# Altium project PCB_Buck_2.PrjPcb
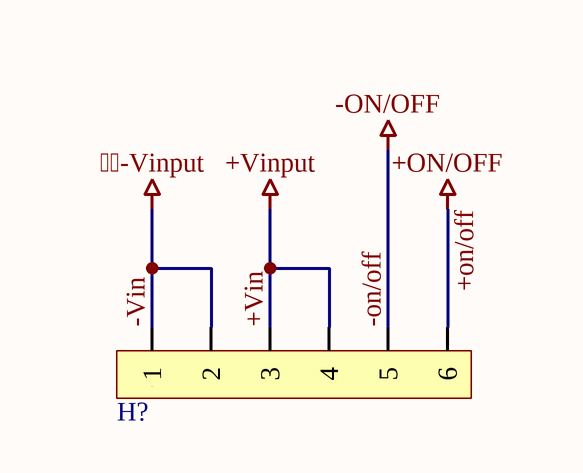
[diagram p0: Sheet1.SchDoc]
1 sheet, 1 parts. Net scope: global (net labels, ports and power ports of the same name join across sheets).
Board file: PCB1.PcbDoc

## Sheet Sheet1.SchDoc
size A4; SheetNumber: 1; SheetTotal: 1

### Parts
H1  PPTC061LFBN-RC  [+/- Vinput, on/off]  (value not drawn)

### Nets
+on/off: H1.?6(6)
+Vin: H1.?3(3) H1.?4(4)  [also labelled +Vinput]
-on/off: H1.?5(5)
-Vin: H1.?1(1) H1.?2(2)  [also labelled -Vinput]

### Library data of the parts
H1 = PPTC061LFBN-RC: Female, 6 C, Straight, .100"CC; 3.20mm Tail, No Mt. 100u" Tin; PBT, Phos Bronze, 105 C; Manufacturer: Sullins; Number of Positions: 6; Connector Type: Header; Voltage Rating: 250V; Pitch: 2.54mm; Supplier: Digi-Key; Supplier Part Number: S7004-ND; Manufacturer Part Number: PPTC061LFBN-RC; RoHS: Yes; Category: Connectors; Stock: 36910; Pricing: 1=0.52, 10=0.449, 80=0.3705, 440=0.3222, 1000=0.26582, 5000=0.2336, 10000=0.2327 (USD); Mounting Technology: Through Hole; Contact Material: Bronze; Housing Material: Plastic; Contact Finish - Mating: TIN; Insulation Color: Black; Insulation Material: Polyester; Contact Shape: Square; Min Operating Temperature: -40°C; Max Operating Temperature: 105°C; Number of Rows: 1; Packaging: Tray; Termination: Solder; Contact Type: Female Socket; Fastening Type: Pull; Series: -; Length: 15.7mm; Width: 2.5mm; Height: 8.5mm; Lead Free: Lead Free; RoHS Compliant: Yes; Flammability Rating: UL94 V-0; ComponentLink1URL: https://media.digikey.com/pdf/Data%20Sheets/Sullins%20PDFs/Female_Headers.100_DS.pdf?src-supplier=Digi-Key; ComponentLink1Description: https://media.digikey.com/pdf/Data%20Sheets/Sullins%20PDFs/Female_Headers.100_DS.pdf?src-supplier=Digi-Key; ComponentLink2URL: http://www.sullinscorp.com/catalogs/78_Page80-81_HEADER_.100_2.54mm_FEMALE.pdf?src-supplier=Future+Electronics; ComponentLink2Description: http://www.sullinscorp.com/catalogs/78_Page80-81_HEADER_.100_2.54mm_FEMALE.pdf?src-supplier=Future+Electronics